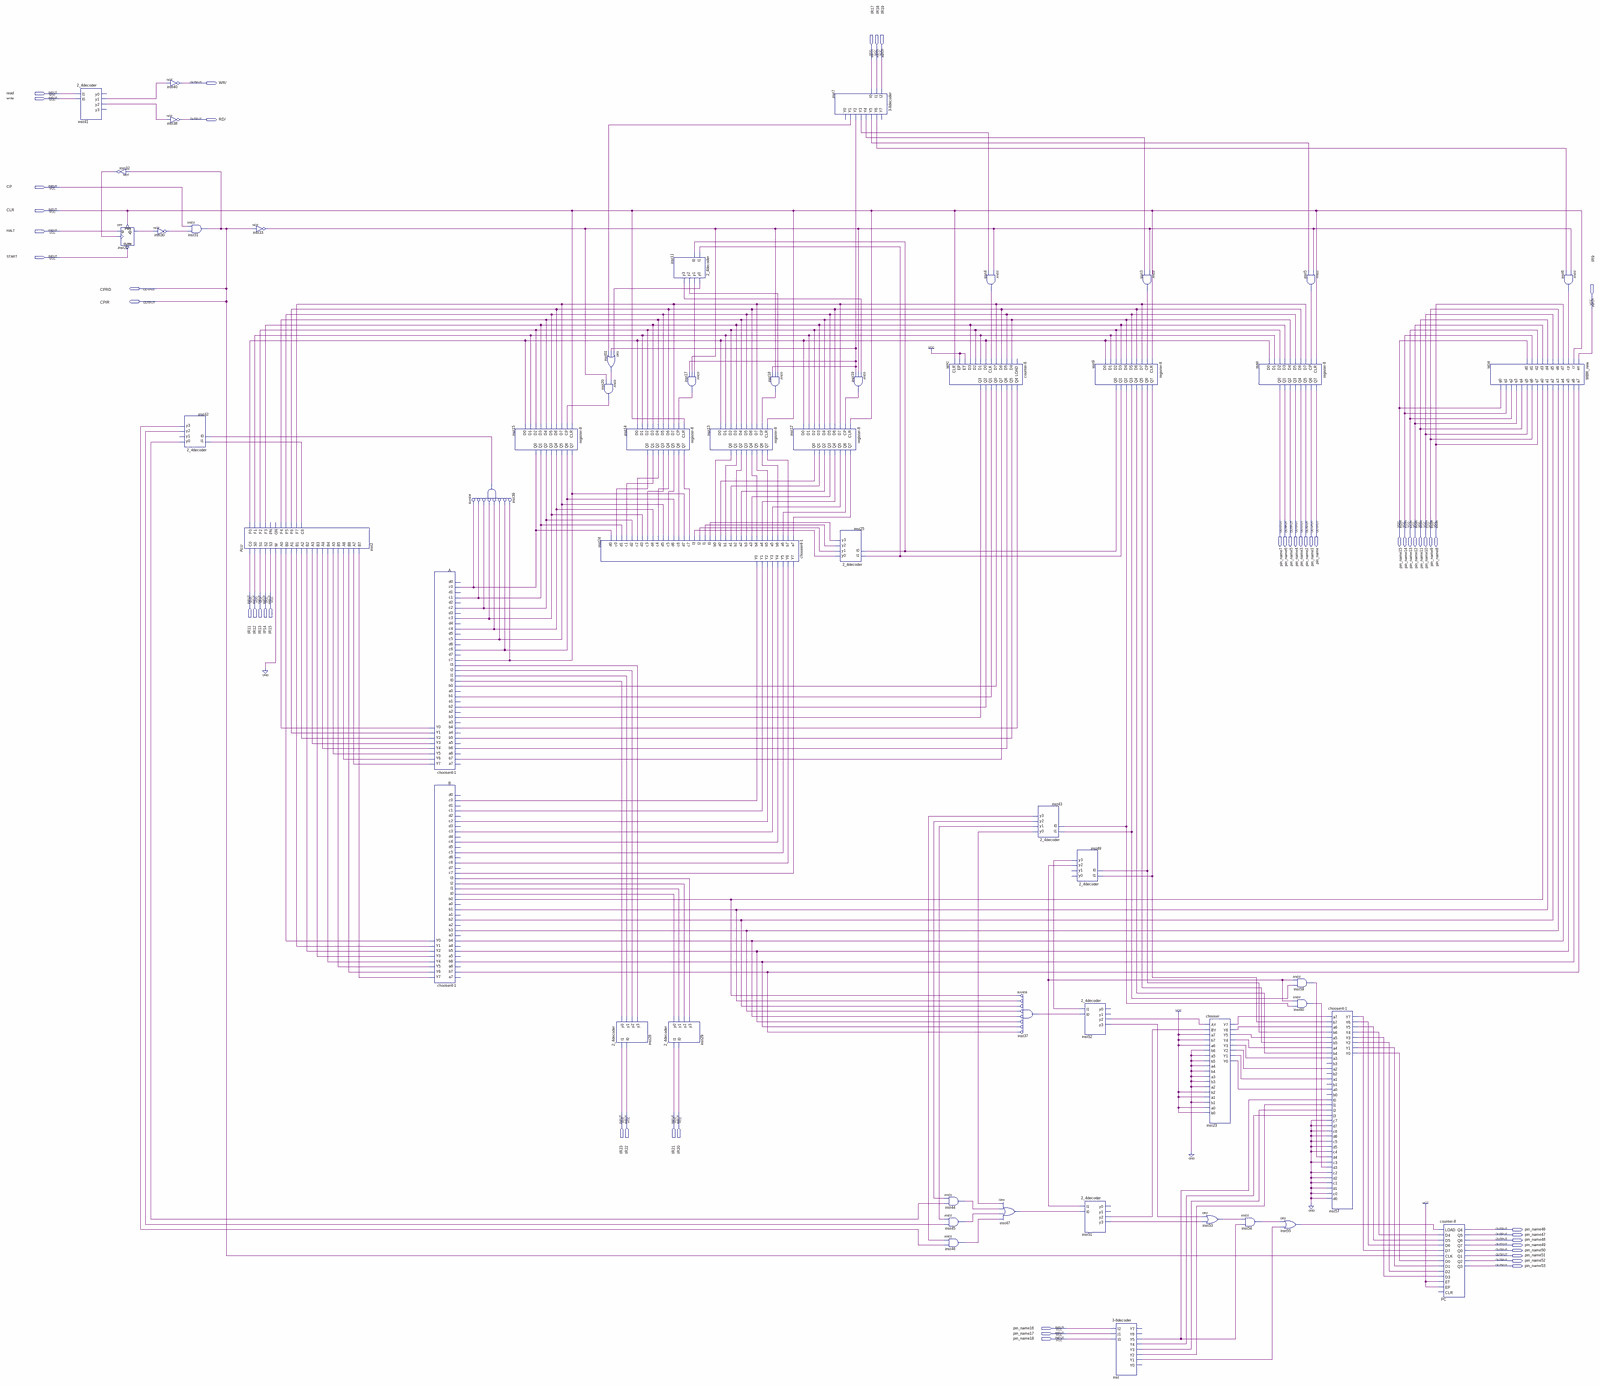
[diagram p0: schematic sheet, whole]
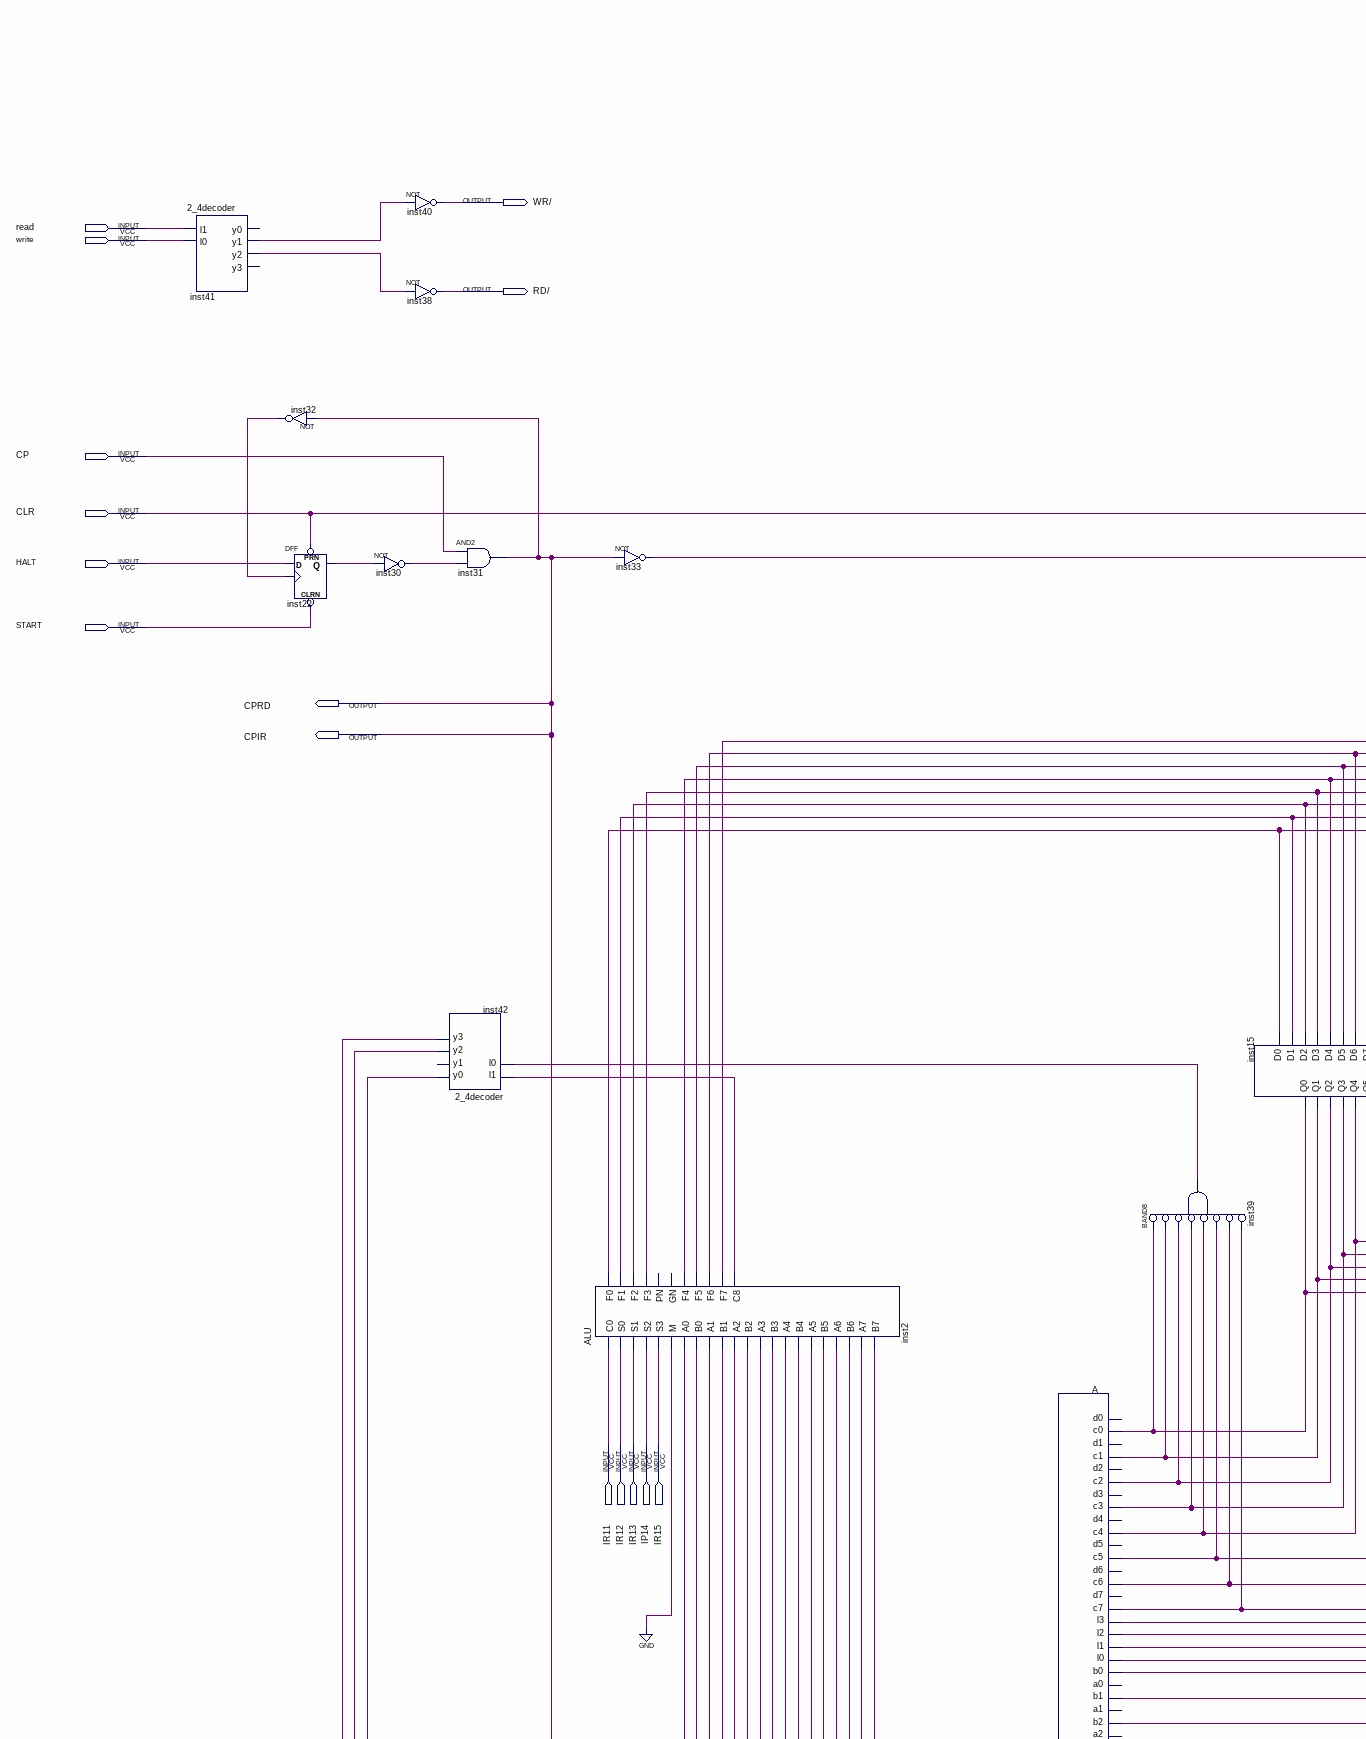
[diagram p1: schematic sheet, upper left part]
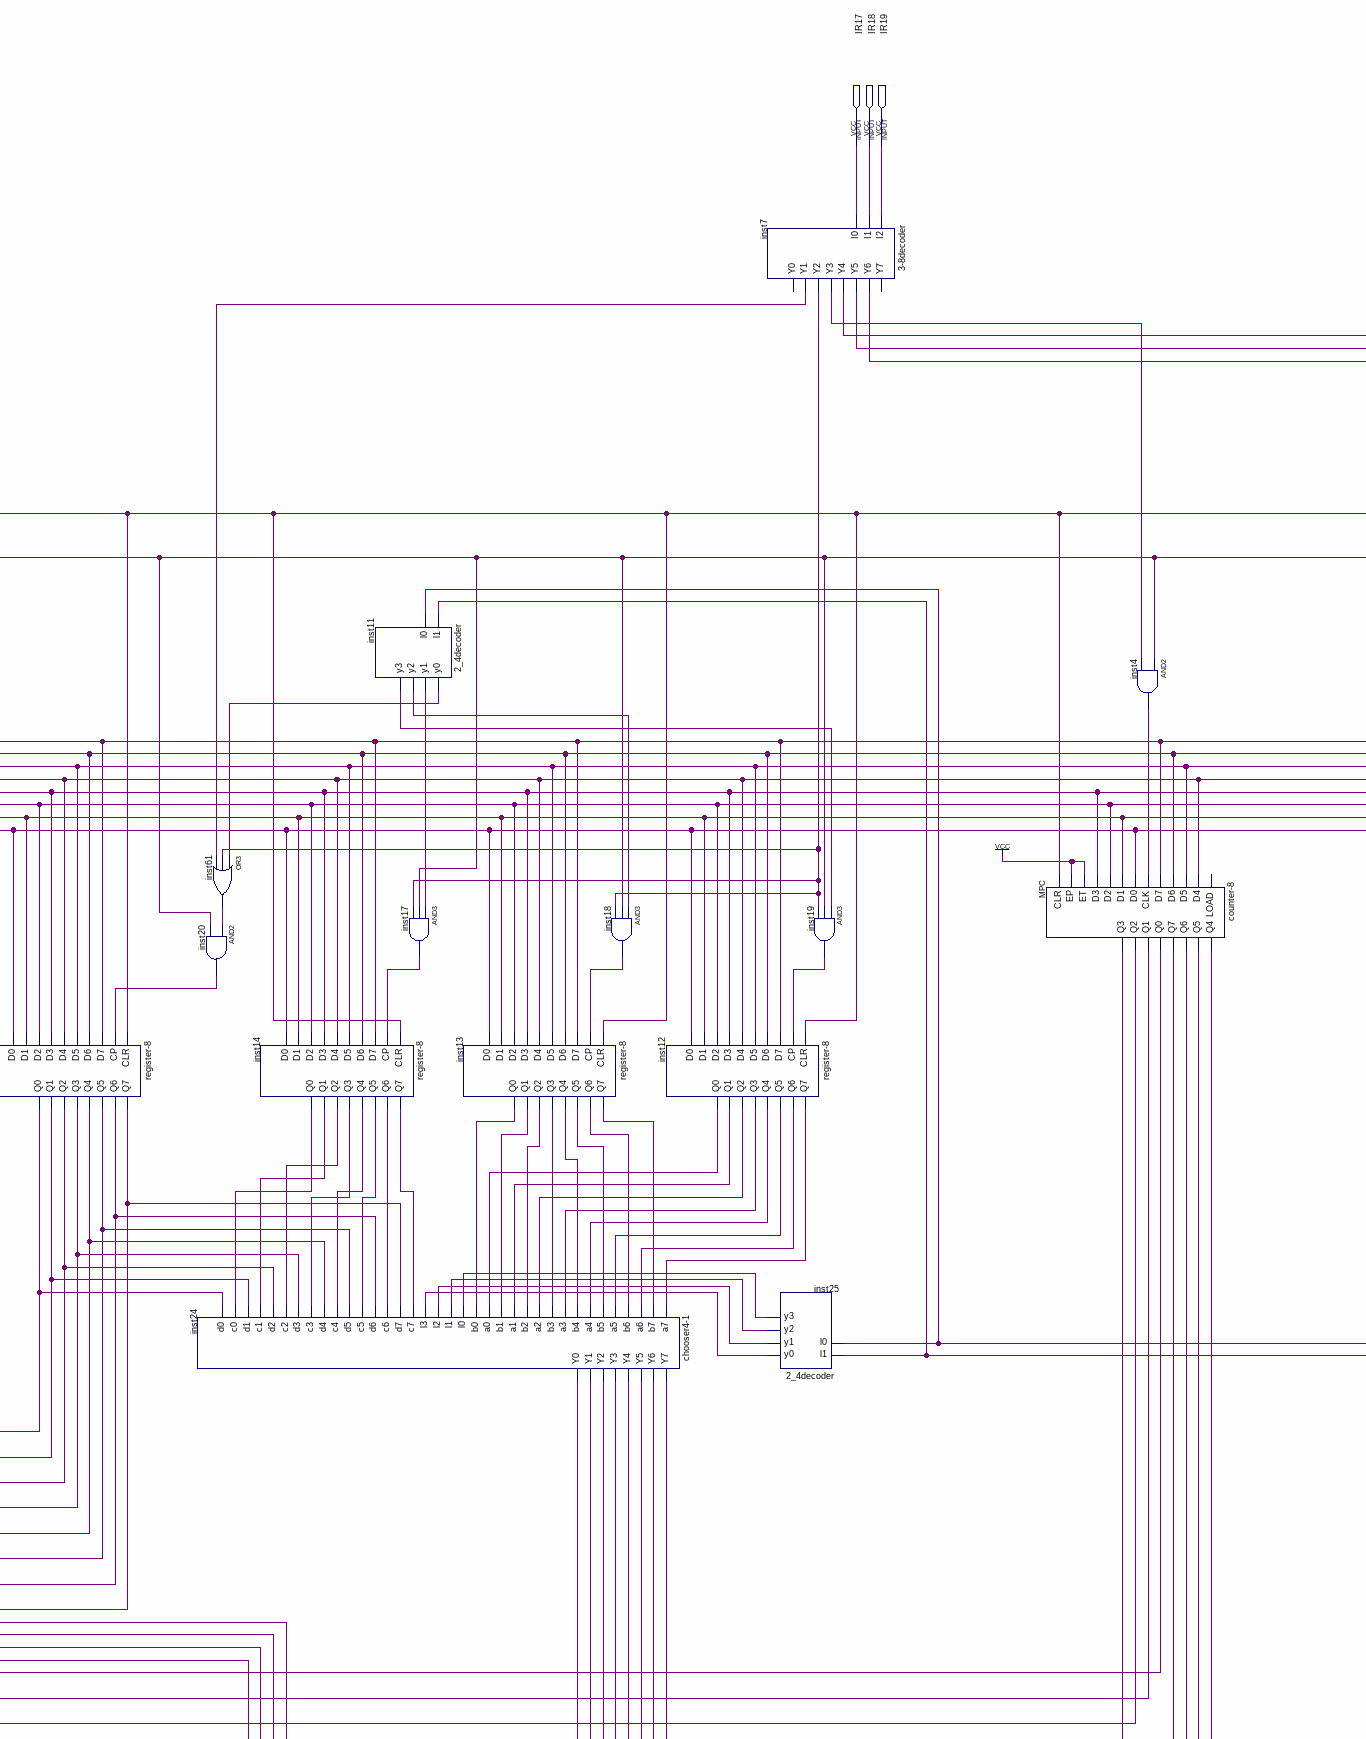
[diagram p2: schematic sheet, upper centre part]
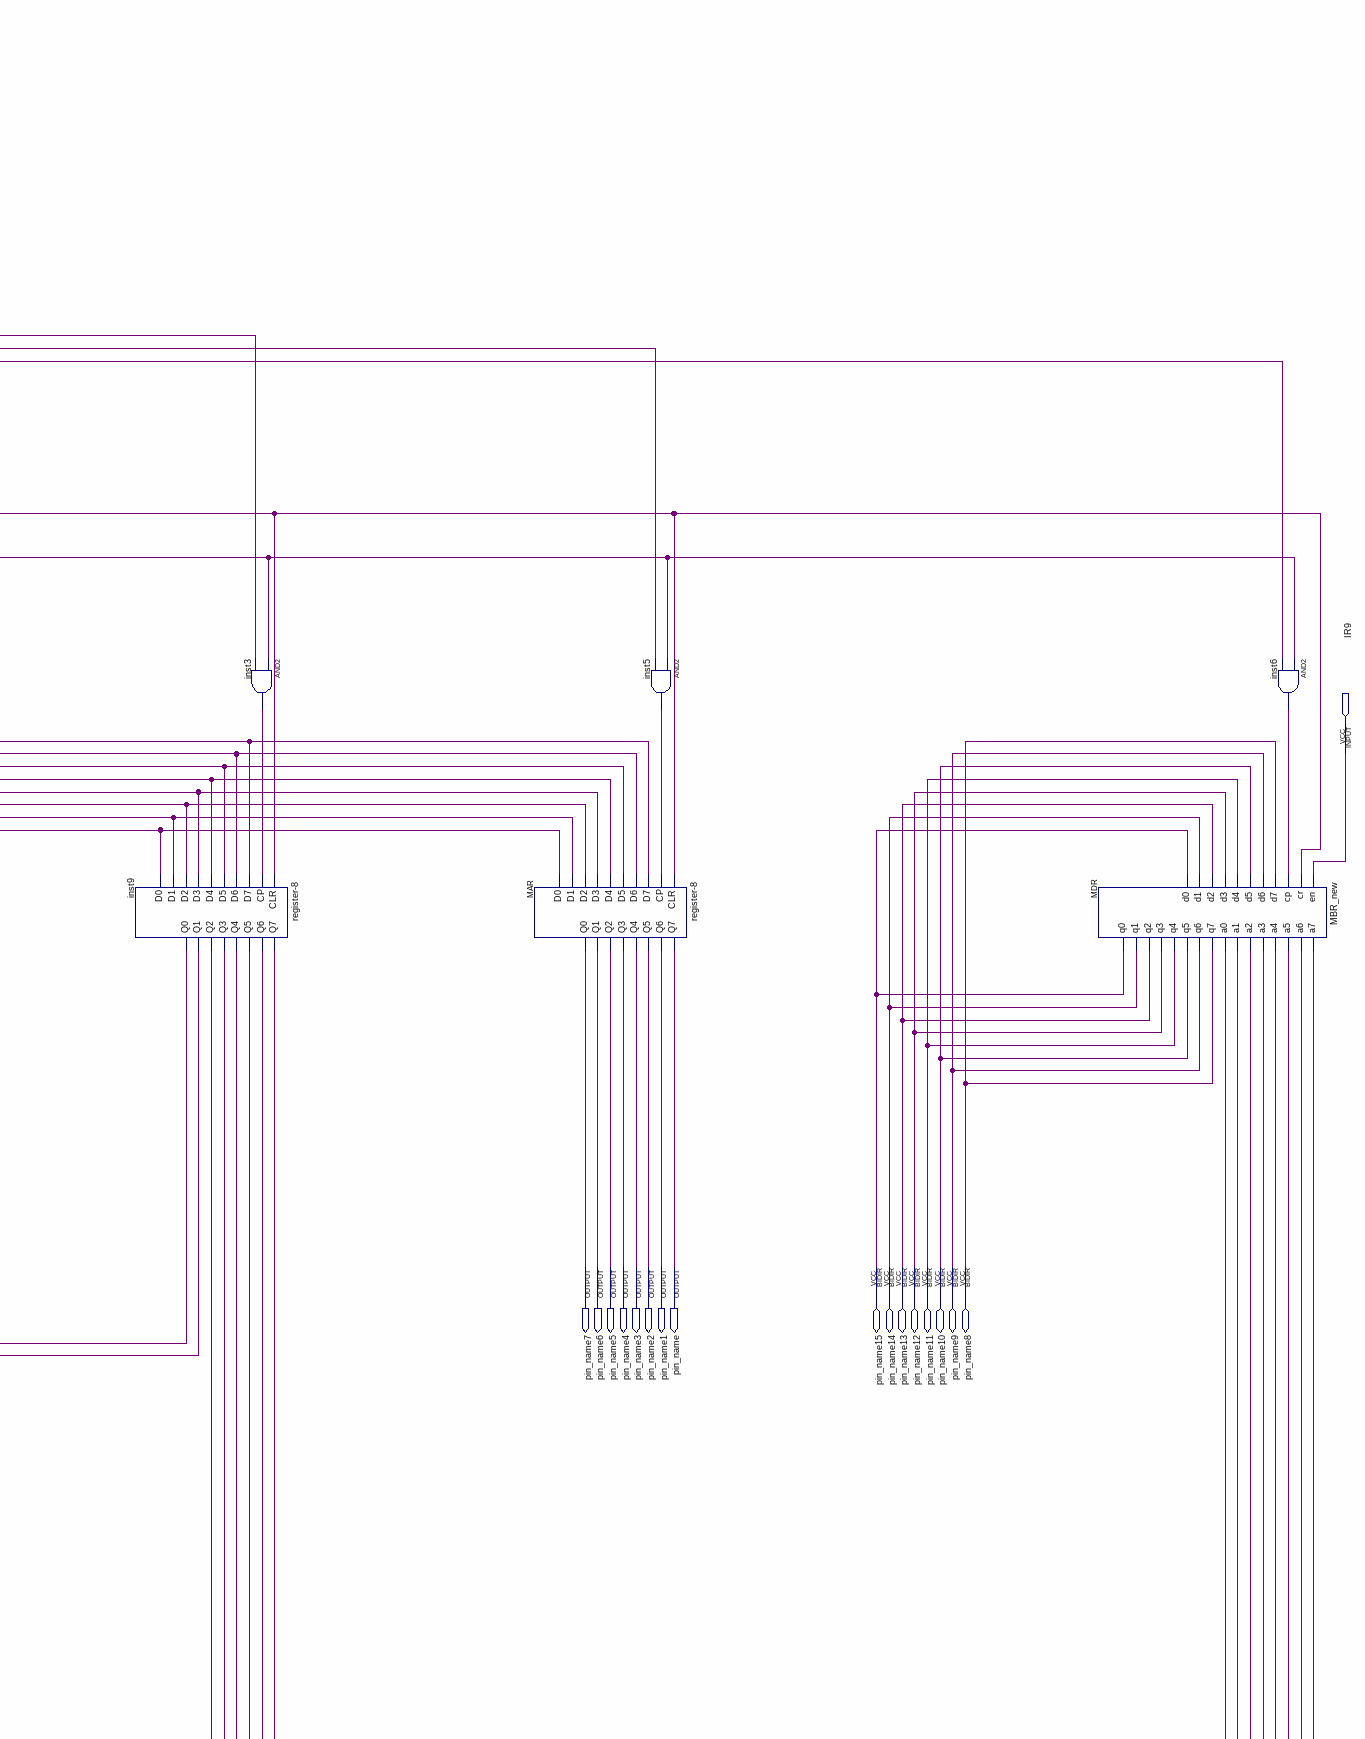
[diagram p3: schematic sheet, upper right part]
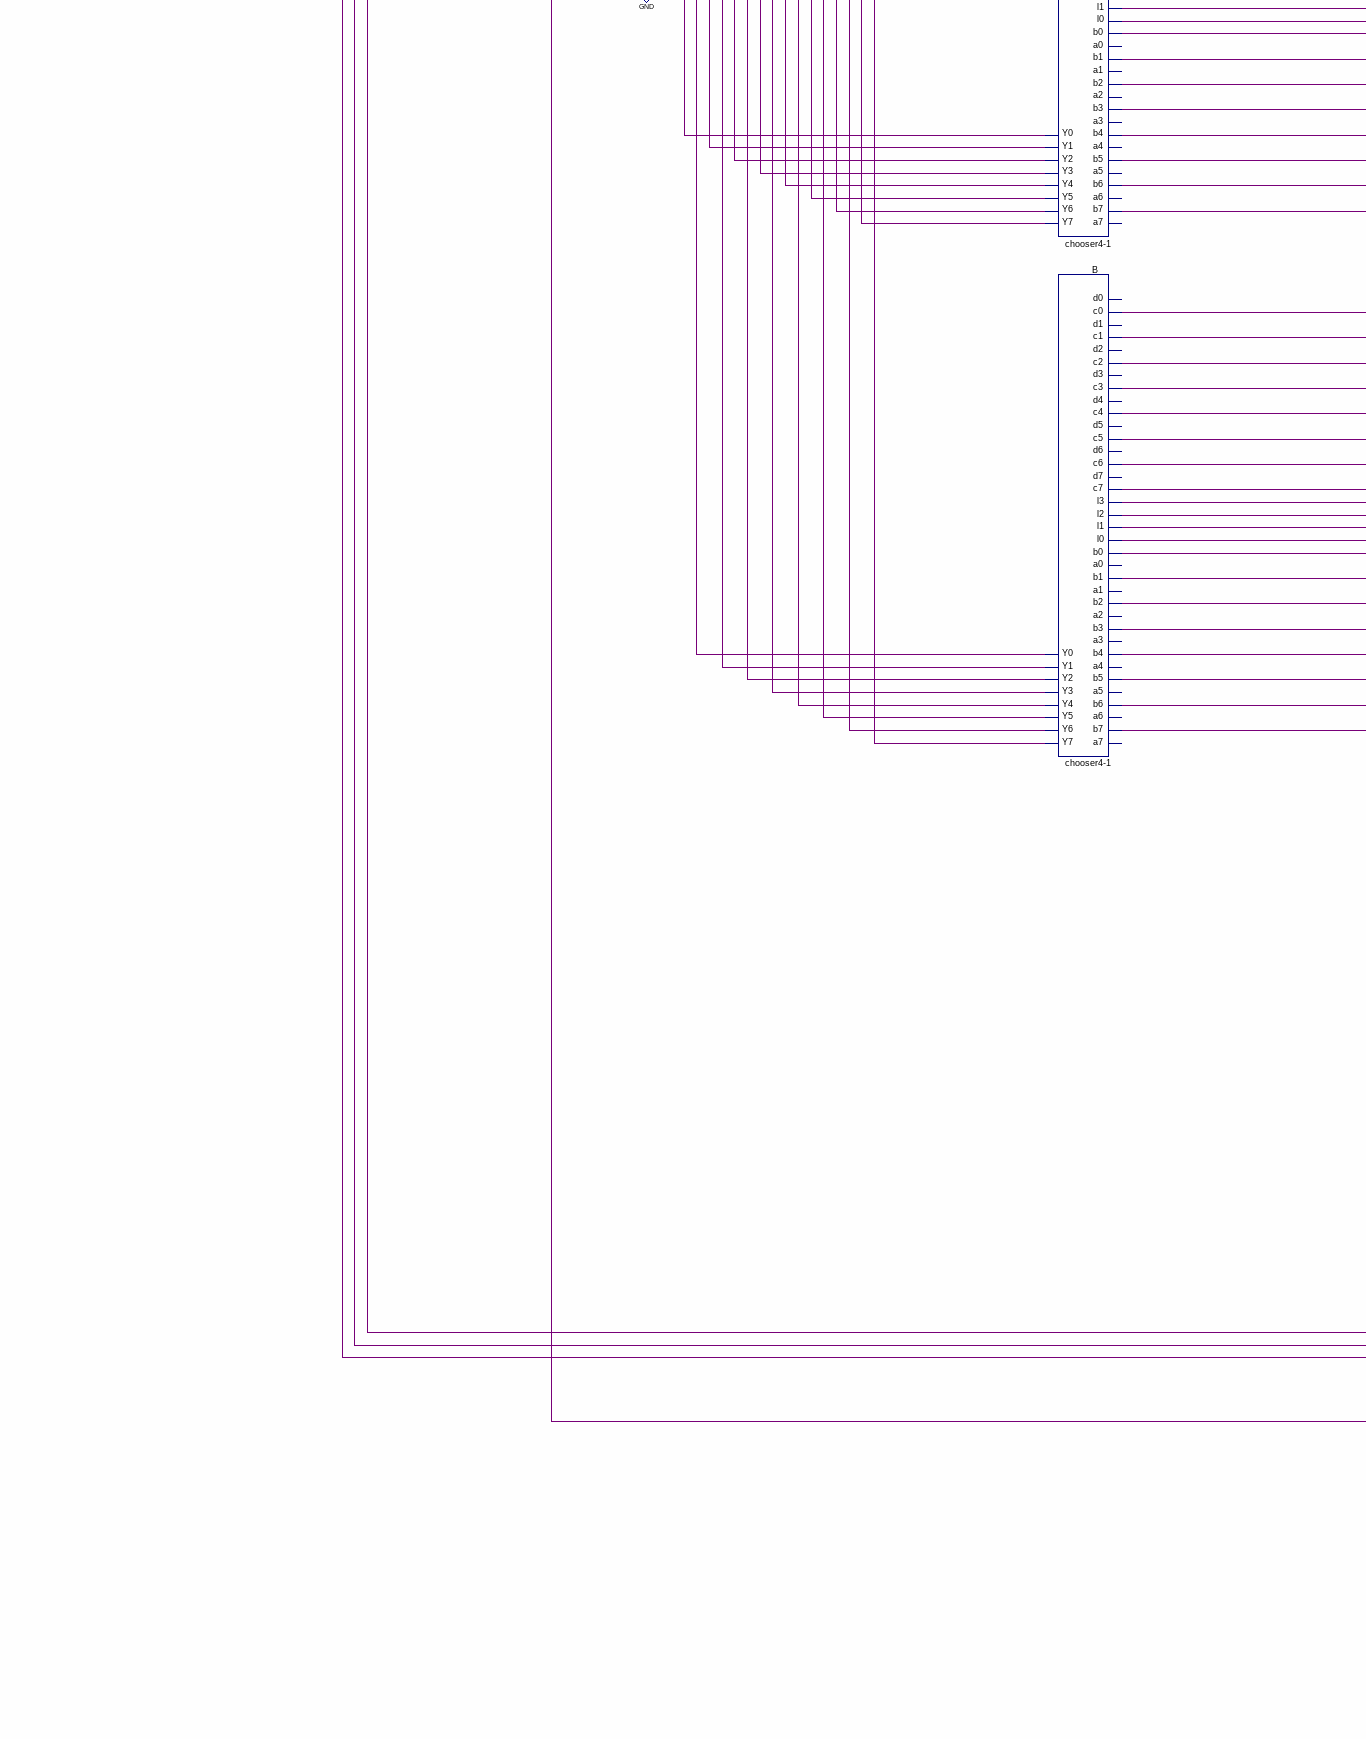
[diagram p4: schematic sheet, lower left part]
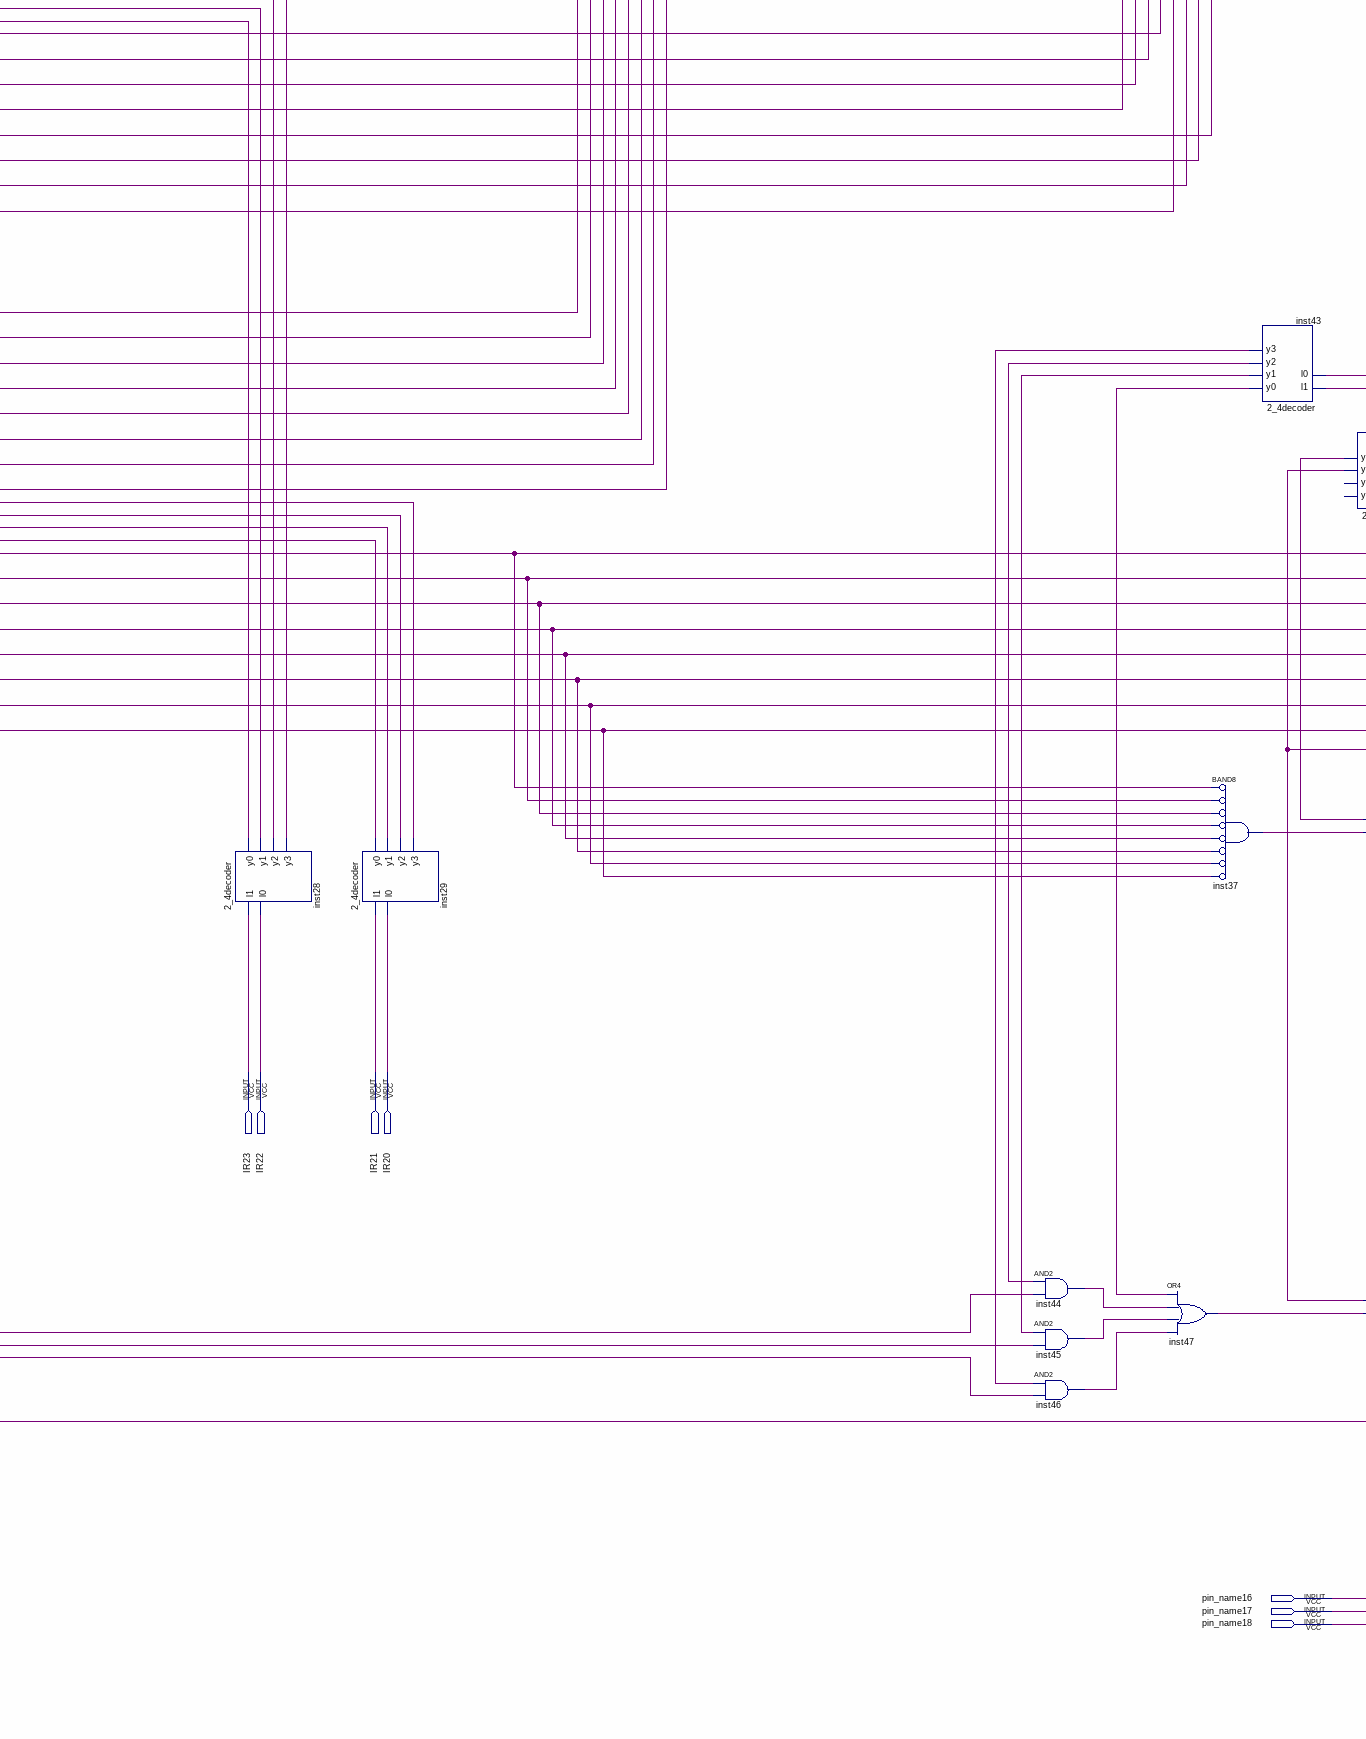
[diagram p5: schematic sheet, lower centre part]
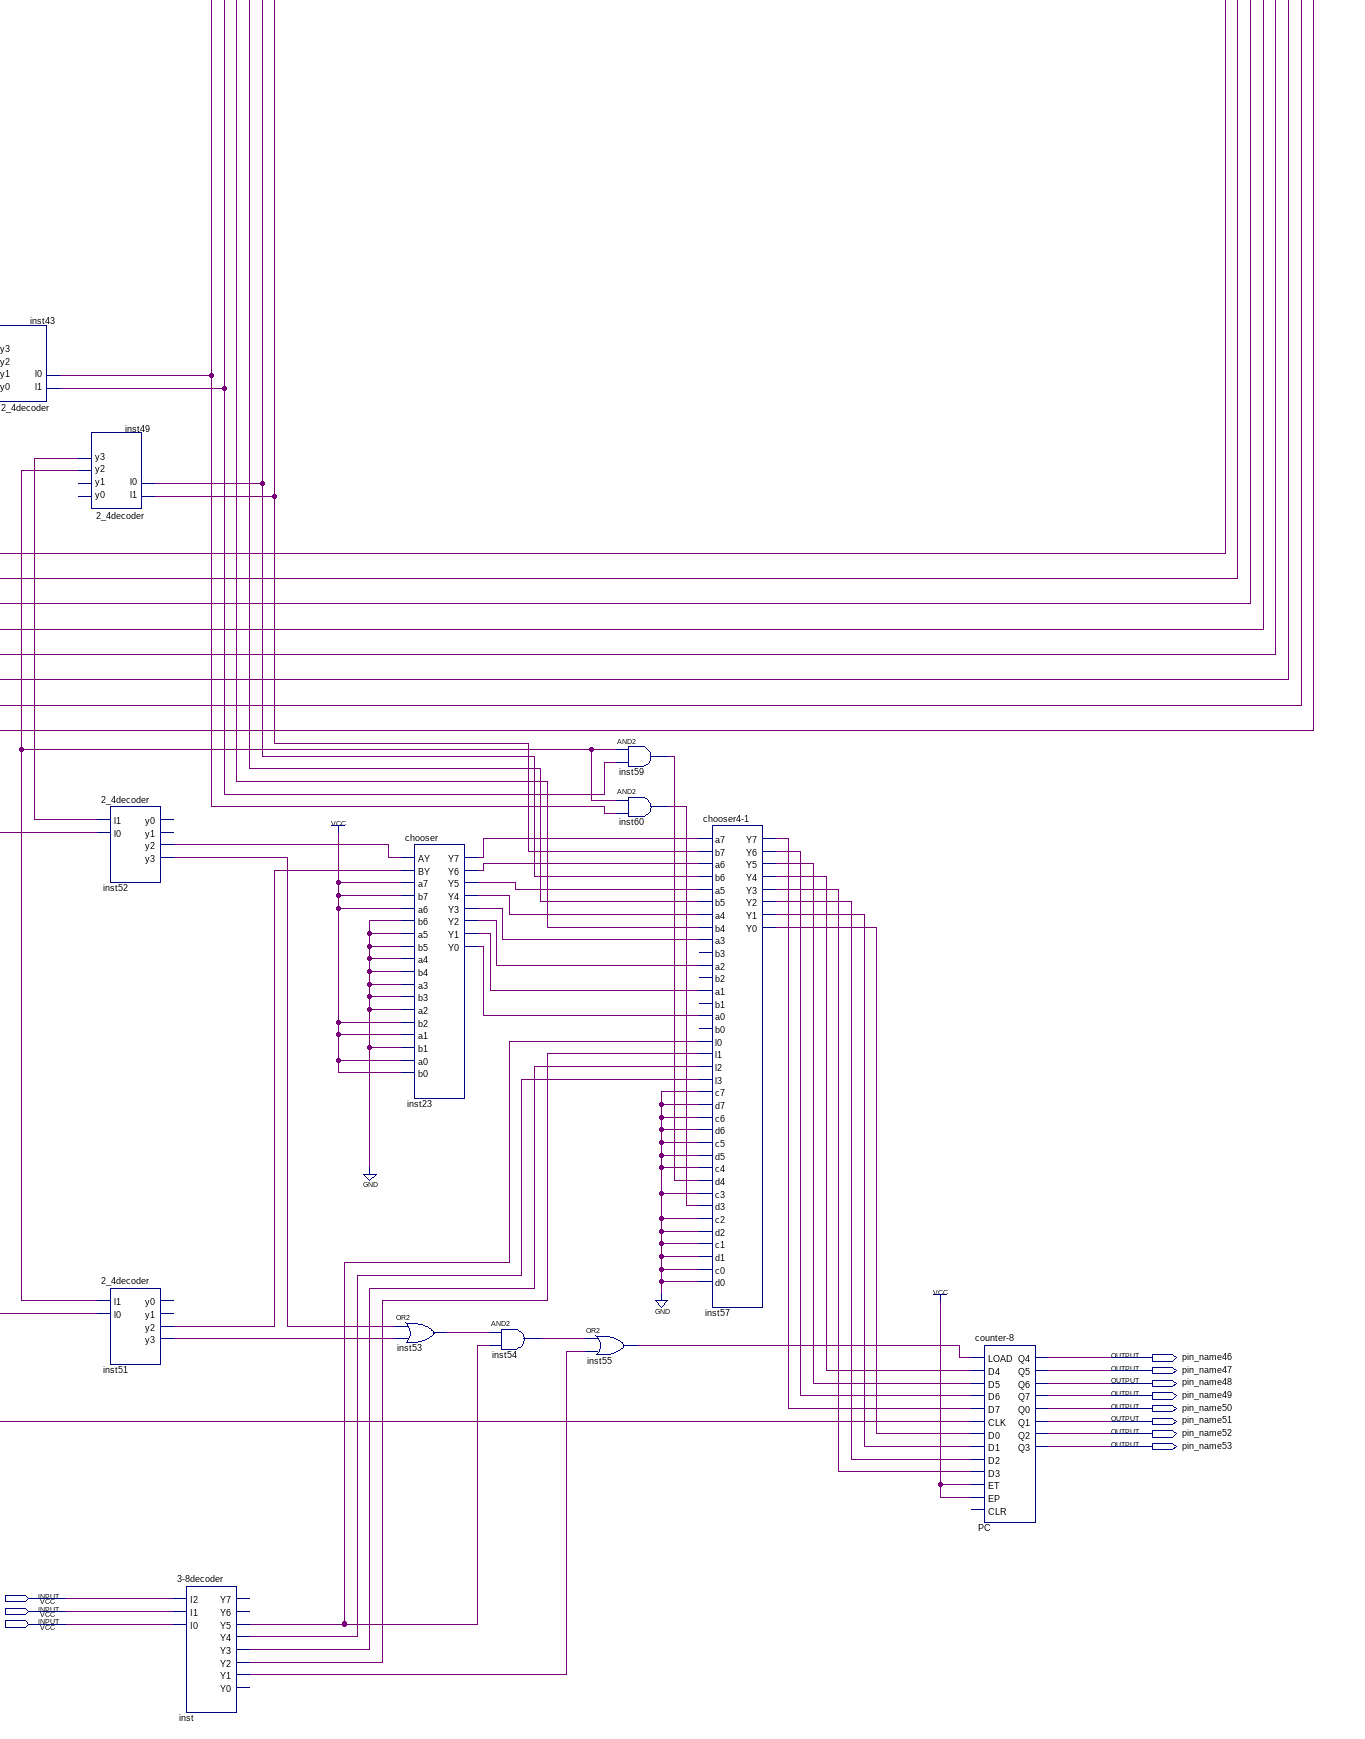
[diagram p6: schematic sheet, lower right part]
// Quartus schematic project.bdf as structural Verilog: 54 symbols, 50 pins
module project (
  input  IR17,
  input  IR18,
  input  IR19,
  input  read,
  input  write,
  input  CP,
  input  CLR,
  input  HALT,
  input  START,
  input  IR9,
  input  IR11,
  input  IR12,
  input  IR13,
  input  IP14,
  input  IR15,
  input  IR23,
  input  IR22,
  input  IR21,
  input  IR20,
  input  pin_name16,
  input  pin_name17,
  input  pin_name18,
  inout  pin_name15,
  inout  pin_name14,
  inout  pin_name13,
  inout  pin_name12,
  inout  pin_name11,
  inout  pin_name10,
  inout  pin_name9,
  inout  pin_name8,
  output \WR/ ,
  output \RD/ ,
  output CPRD,
  output CPIR,
  output pin_name7,
  output pin_name6,
  output pin_name5,
  output pin_name4,
  output pin_name3,
  output pin_name2,
  output pin_name1,
  output pin_name,
  output pin_name46,
  output pin_name47,
  output pin_name48,
  output pin_name49,
  output pin_name50,
  output pin_name51,
  output pin_name52,
  output pin_name53
);

  wire A_y0, A_y1, A_y2, A_y3, A_y4, A_y5, A_y6, A_y7, B_y0, B_y1, B_y2, B_y3, B_y4, B_y5, B_y6, B_y7,
       inst2_c8, inst2_f0, inst2_f1, inst2_f2, inst2_f3, inst2_f4, inst2_f5, inst2_f6, inst2_f7, inst3_out,
       inst4_out, inst5_out, inst6_out, inst7_y1, inst7_y2, inst7_y3, inst7_y4, inst7_y5, inst7_y6, inst9_q0,
       inst9_q1, inst9_q2, inst9_q3, inst9_q4, inst9_q5, inst9_q6, inst9_q7, inst11_y0, inst11_y1, inst11_y2,
       inst11_y3, inst12_q0, inst12_q1, inst12_q2, inst12_q3, inst12_q4, inst12_q5, inst12_q6, inst12_q7,
       inst13_q0, inst13_q1, inst13_q2, inst13_q3, inst13_q4, inst13_q5, inst13_q6, inst13_q7, inst14_q0,
       inst14_q1, inst14_q2, inst14_q3, inst14_q4, inst14_q5, inst14_q6, inst14_q7, inst15_q0, inst15_q1,
       inst15_q2, inst15_q3, inst15_q4, inst15_q5, inst15_q6, inst15_q7, inst17_out, inst18_out, inst19_out,
       inst20_out, inst22_q, inst23_y0, inst23_y1, inst23_y2, inst23_y3, inst23_y4, inst23_y5, inst23_y6,
       inst23_y7, inst24_y0, inst24_y1, inst24_y2, inst24_y3, inst24_y4, inst24_y5, inst24_y6, inst24_y7,
       inst25_y0, inst25_y1, inst25_y2, inst25_y3, inst28_y0, inst28_y1, inst28_y2, inst28_y3, inst29_y0,
       inst29_y1, inst29_y2, inst29_y3, inst30_out, inst32_out, inst33_out, inst37_out, inst39_out,
       inst41_y1, inst41_y2, inst42_y0, inst42_y2, inst42_y3, inst43_y0, inst43_y1, inst43_y2, inst43_y3,
       inst44_out, inst45_out, inst46_out, inst47_out, inst49_y2, inst49_y3, inst51_y2, inst51_y3, inst52_y2,
       inst52_y3, inst53_out, inst54_out, inst55_out, inst57_y0, inst57_y1, inst57_y2, inst57_y3, inst57_y4,
       inst57_y5, inst57_y6, inst57_y7, inst59_out, inst60_out, inst61_out, inst_y1, inst_y2, inst_y3,
       inst_y4, inst_y5, MDR_a0, MDR_a1, MDR_a2, MDR_a3, MDR_a4, MDR_a5, MDR_a6, MDR_a7, MPC_q0, MPC_q1,
       MPC_q2, MPC_q3, MPC_q4, MPC_q5, MPC_q6, MPC_q7;

  \2_4decoder  inst41 (.l1(read), .l0(write), .y1(inst41_y1), .y2(inst41_y2));  // open: y0, y3
  not inst32 (inst32_out, CPIR);
  DFF inst22 (.CLRN(START), .CLK(inst32_out), .D(HALT), .PRN(CLR), .Q(inst22_q));
  not inst30 (inst30_out, inst22_q);
  not inst40 (\WR/ , inst41_y1);
  not inst38 (\RD/ , inst41_y2);
  and inst31 (CPIR, CP, inst30_out);
  \2_4decoder  inst42 (.l1(inst2_c8), .l0(inst39_out), .y0(inst42_y0), .y2(inst42_y2), .y3(inst42_y3));  // open: y1
  not inst33 (inst33_out, CPIR);
  ALU inst2 (
    .C0(IR11), .S0(IR12), .S1(IR13), .S2(IP14), .S3(IR15), .M(1'b0), .A0(A_y0), .B0(B_y0), .A1(A_y1),
    .B1(B_y1), .A2(A_y2), .B2(B_y2), .A3(A_y3), .B3(B_y3), .A4(A_y4), .B4(B_y4), .A5(A_y5), .B5(B_y5),
    .A6(A_y6), .B6(B_y6), .A7(A_y7), .B7(B_y7), .F0(inst2_f0), .F1(inst2_f1), .F2(inst2_f2), .F3(inst2_f3),
    .F4(inst2_f4), .F5(inst2_f5), .F6(inst2_f6), .F7(inst2_f7), .C8(inst2_c8));  // open: PN, GN
  \chooser4-1  A (
    .b7(MPC_q7), .b6(MPC_q6), .b5(MPC_q5), .b4(MPC_q4), .b3(MPC_q3), .b2(MPC_q2), .b1(MPC_q1), .b0(MPC_q0),
    .l0(inst28_y0), .l1(inst28_y1), .l2(inst28_y2), .l3(inst28_y3), .c7(inst15_q7), .c6(inst15_q6),
    .c5(inst15_q5), .c4(inst15_q4), .c3(inst15_q3), .c2(inst15_q2), .c1(inst15_q1), .c0(inst15_q0),
    .Y7(A_y7), .Y6(A_y6), .Y5(A_y5), .Y4(A_y4), .Y3(A_y3), .Y2(A_y2), .Y1(A_y1), .Y0(A_y0));  // open: a7, a6, a5, a4, a3, a2, a1, a0, d7, d6, d5, d4, d3, d2, d1, d0
  \chooser4-1  B (
    .b7(MDR_a7), .b6(MDR_a6), .b5(MDR_a5), .b4(MDR_a4), .b3(MDR_a3), .b2(MDR_a2), .b1(MDR_a1), .b0(MDR_a0),
    .l0(inst29_y0), .l1(inst29_y1), .l2(inst29_y2), .l3(inst29_y3), .c7(inst24_y7), .c6(inst24_y6),
    .c5(inst24_y5), .c4(inst24_y4), .c3(inst24_y3), .c2(inst24_y2), .c1(inst24_y1), .c0(inst24_y0),
    .Y7(B_y7), .Y6(B_y6), .Y5(B_y5), .Y4(B_y4), .Y3(B_y3), .Y2(B_y2), .Y1(B_y1), .Y0(B_y0));  // open: a7, a6, a5, a4, a3, a2, a1, a0, d7, d6, d5, d4, d3, d2, d1, d0
  and inst39 (inst39_out, ~inst15_q0, ~inst15_q1, ~inst15_q2, ~inst15_q3, ~inst15_q4, ~inst15_q5, ~inst15_q6, ~inst15_q7);  // BAND8
  \register-8  inst15 (
    .CLR(CLR), .CP(inst20_out), .D7(inst2_f7), .D6(inst2_f6), .D5(inst2_f5), .D4(inst2_f4), .D3(inst2_f3),
    .D2(inst2_f2), .D1(inst2_f1), .D0(inst2_f0), .Q7(inst15_q7), .Q6(inst15_q6), .Q5(inst15_q5),
    .Q4(inst15_q4), .Q3(inst15_q3), .Q2(inst15_q2), .Q1(inst15_q1), .Q0(inst15_q0));
  or inst61 (inst61_out, inst11_y0, inst7_y2, inst7_y1);
  and inst20 (inst20_out, inst61_out, inst33_out);
  \chooser4-1  inst24 (
    .a7(inst12_q7), .b7(inst13_q7), .a6(inst12_q6), .b6(inst13_q6), .a5(inst12_q5), .b5(inst13_q5),
    .a4(inst12_q4), .b4(inst13_q4), .a3(inst12_q3), .b3(inst13_q3), .a2(inst12_q2), .b2(inst13_q2),
    .a1(inst12_q1), .b1(inst13_q1), .a0(inst12_q0), .b0(inst13_q0), .l0(inst25_y3), .l1(inst25_y2),
    .l2(inst25_y1), .l3(inst25_y0), .c7(inst14_q7), .d7(inst15_q7), .c6(inst14_q6), .d6(inst15_q6),
    .c5(inst14_q5), .d5(inst15_q5), .c4(inst14_q4), .d4(inst15_q4), .c3(inst14_q3), .d3(inst15_q3),
    .c2(inst14_q2), .d2(inst15_q2), .c1(inst14_q1), .d1(inst15_q1), .c0(inst14_q0), .d0(inst15_q0),
    .Y7(inst24_y7), .Y6(inst24_y6), .Y5(inst24_y5), .Y4(inst24_y4), .Y3(inst24_y3), .Y2(inst24_y2),
    .Y1(inst24_y1), .Y0(inst24_y0));
  \2_4decoder  inst28 (.l1(IR23), .l0(IR22), .y0(inst28_y0), .y1(inst28_y1), .y2(inst28_y2), .y3(inst28_y3));
  \register-8  inst14 (
    .CLR(CLR), .CP(inst17_out), .D7(inst2_f7), .D6(inst2_f6), .D5(inst2_f5), .D4(inst2_f4), .D3(inst2_f3),
    .D2(inst2_f2), .D1(inst2_f1), .D0(inst2_f0), .Q7(inst14_q7), .Q6(inst14_q6), .Q5(inst14_q5),
    .Q4(inst14_q4), .Q3(inst14_q3), .Q2(inst14_q2), .Q1(inst14_q1), .Q0(inst14_q0));
  \2_4decoder  inst11 (.l1(inst9_q1), .l0(inst9_q0), .y0(inst11_y0), .y1(inst11_y1), .y2(inst11_y2), .y3(inst11_y3));
  \2_4decoder  inst29 (.l1(IR21), .l0(IR20), .y0(inst29_y0), .y1(inst29_y1), .y2(inst29_y2), .y3(inst29_y3));
  and inst17 (inst17_out, inst11_y1, inst33_out, inst7_y2);
  \register-8  inst13 (
    .CLR(CLR), .CP(inst18_out), .D7(inst2_f7), .D6(inst2_f6), .D5(inst2_f5), .D4(inst2_f4), .D3(inst2_f3),
    .D2(inst2_f2), .D1(inst2_f1), .D0(inst2_f0), .Q7(inst13_q7), .Q6(inst13_q6), .Q5(inst13_q5),
    .Q4(inst13_q4), .Q3(inst13_q3), .Q2(inst13_q2), .Q1(inst13_q1), .Q0(inst13_q0));
  and inst18 (inst18_out, inst11_y2, inst33_out, inst7_y2);
  \register-8  inst12 (
    .CLR(CLR), .CP(inst19_out), .D7(inst2_f7), .D6(inst2_f6), .D5(inst2_f5), .D4(inst2_f4), .D3(inst2_f3),
    .D2(inst2_f2), .D1(inst2_f1), .D0(inst2_f0), .Q7(inst12_q7), .Q6(inst12_q6), .Q5(inst12_q5),
    .Q4(inst12_q4), .Q3(inst12_q3), .Q2(inst12_q2), .Q1(inst12_q1), .Q0(inst12_q0));
  \3-8decoder  inst7 (
    .I2(IR19), .I1(IR18), .I0(IR17), .Y6(inst7_y6), .Y5(inst7_y5), .Y4(inst7_y4), .Y3(inst7_y3),
    .Y2(inst7_y2), .Y1(inst7_y1));  // open: Y7, Y0
  \2_4decoder  inst25 (.l1(inst9_q1), .l0(inst9_q0), .y0(inst25_y0), .y1(inst25_y1), .y2(inst25_y2), .y3(inst25_y3));
  and inst19 (inst19_out, inst11_y3, inst33_out, inst7_y2);
  \counter-8  MPC (
    .D4(inst2_f4), .D5(inst2_f5), .D6(inst2_f6), .D7(inst2_f7), .CLK(inst4_out), .D0(inst2_f0),
    .D1(inst2_f1), .D2(inst2_f2), .D3(inst2_f3), .ET(1'b1), .EP(1'b1), .CLR(CLR), .Q4(MPC_q4), .Q5(MPC_q5),
    .Q6(MPC_q6), .Q7(MPC_q7), .Q0(MPC_q0), .Q1(MPC_q1), .Q2(MPC_q2), .Q3(MPC_q3));  // open: LOAD
  and inst44 (inst44_out, inst43_y2, inst42_y0);
  and inst45 (inst45_out, inst43_y1, inst42_y2);
  and inst46 (inst46_out, inst43_y3, inst42_y3);
  and inst4 (inst4_out, inst33_out, inst7_y3);
  or inst47 (inst47_out, inst43_y0, inst44_out, inst45_out, inst46_out);
  and inst37 (inst37_out, ~MDR_a0, ~MDR_a1, ~MDR_a2, ~MDR_a3, ~MDR_a4, ~MDR_a5, ~MDR_a6, ~MDR_a7);  // BAND8
  \2_4decoder  inst43 (.l1(inst9_q3), .l0(inst9_q2), .y0(inst43_y0), .y1(inst43_y1), .y2(inst43_y2), .y3(inst43_y3));
  \register-8  inst9 (
    .CLR(CLR), .CP(inst3_out), .D7(inst2_f7), .D6(inst2_f6), .D5(inst2_f5), .D4(inst2_f4), .D3(inst2_f3),
    .D2(inst2_f2), .D1(inst2_f1), .D0(inst2_f0), .Q7(inst9_q7), .Q6(inst9_q6), .Q5(inst9_q5), .Q4(inst9_q4),
    .Q3(inst9_q3), .Q2(inst9_q2), .Q1(inst9_q1), .Q0(inst9_q0));
  \2_4decoder  inst49 (.l1(inst9_q7), .l0(inst9_q6), .y2(inst49_y2), .y3(inst49_y3));  // open: y0, y1
  \2_4decoder  inst52 (.l1(inst49_y3), .l0(inst37_out), .y2(inst52_y2), .y3(inst52_y3));  // open: y0, y1
  \2_4decoder  inst51 (.l1(inst49_y2), .l0(inst47_out), .y2(inst51_y2), .y3(inst51_y3));  // open: y0, y1
  \3-8decoder  inst (
    .I2(pin_name16), .I1(pin_name17), .I0(pin_name18), .Y5(inst_y5), .Y4(inst_y4), .Y3(inst_y3),
    .Y2(inst_y2), .Y1(inst_y1));  // open: Y7, Y6, Y0
  and inst3 (inst3_out, inst33_out, inst7_y4);
  chooser inst23 (
    .AY(inst52_y2), .BY(inst51_y2), .a7(1'b1), .b7(1'b1), .a6(1'b1), .b6(1'b0), .a5(1'b0), .b5(1'b0),
    .a4(1'b0), .b4(1'b0), .a3(1'b0), .b3(1'b0), .a2(1'b0), .b2(1'b1), .a1(1'b1), .b1(1'b0), .a0(1'b1),
    .b0(1'b1), .Y7(inst23_y7), .Y6(inst23_y6), .Y5(inst23_y5), .Y4(inst23_y4), .Y3(inst23_y3),
    .Y2(inst23_y2), .Y1(inst23_y1), .Y0(inst23_y0));
  or inst53 (inst53_out, inst52_y3, inst51_y3);
  \register-8  MAR (
    .CLR(CLR), .CP(inst5_out), .D7(inst2_f7), .D6(inst2_f6), .D5(inst2_f5), .D4(inst2_f4), .D3(inst2_f3),
    .D2(inst2_f2), .D1(inst2_f1), .D0(inst2_f0), .Q7(pin_name), .Q6(pin_name1), .Q5(pin_name2),
    .Q4(pin_name3), .Q3(pin_name4), .Q2(pin_name5), .Q1(pin_name6), .Q0(pin_name7));
  and inst54 (inst54_out, inst53_out, inst_y5);
  and inst59 (inst59_out, inst49_y2, inst9_q3);
  and inst60 (inst60_out, inst49_y2, inst9_q2);
  or inst55 (inst55_out, inst54_out, inst_y1);
  and inst5 (inst5_out, inst33_out, inst7_y5);
  \chooser4-1  inst57 (
    .a7(inst23_y7), .b7(inst9_q7), .a6(inst23_y6), .b6(inst9_q6), .a5(inst23_y5), .b5(inst9_q5),
    .a4(inst23_y4), .b4(inst9_q4), .a3(inst23_y3), .a2(inst23_y2), .a1(inst23_y1), .a0(inst23_y0),
    .l0(inst_y5), .l1(inst_y2), .l2(inst_y3), .l3(inst_y4), .c7(1'b0), .d7(1'b0), .c6(1'b0), .d6(1'b0),
    .c5(1'b0), .d5(1'b0), .c4(1'b0), .d4(inst59_out), .c3(1'b0), .d3(inst60_out), .c2(1'b0), .d2(1'b0),
    .c1(1'b0), .d1(1'b0), .c0(1'b0), .d0(1'b0), .Y7(inst57_y7), .Y6(inst57_y6), .Y5(inst57_y5),
    .Y4(inst57_y4), .Y3(inst57_y3), .Y2(inst57_y2), .Y1(inst57_y1), .Y0(inst57_y0));  // open: b3, b2, b1, b0
  \counter-8  PC (
    .LOAD(inst55_out), .D4(inst57_y4), .D5(inst57_y5), .D6(inst57_y6), .D7(inst57_y7), .CLK(CPIR),
    .D0(inst57_y0), .D1(inst57_y1), .D2(inst57_y2), .D3(inst57_y3), .ET(1'b1), .EP(1'b1), .Q4(pin_name46),
    .Q5(pin_name47), .Q6(pin_name48), .Q7(pin_name49), .Q0(pin_name50), .Q1(pin_name51), .Q2(pin_name52),
    .Q3(pin_name53));  // open: CLR
  MBR_new MDR (
    .en(IR9), .cr(CLR), .cp(inst6_out), .d7(pin_name8), .d6(pin_name9), .d5(pin_name10), .d4(pin_name11),
    .d3(pin_name12), .d2(pin_name13), .d1(pin_name14), .d0(pin_name15), .a7(MDR_a7), .a6(MDR_a6),
    .a5(MDR_a5), .a4(MDR_a4), .a3(MDR_a3), .a2(MDR_a2), .a1(MDR_a1), .a0(MDR_a0), .q7(pin_name8),
    .q6(pin_name9), .q5(pin_name10), .q4(pin_name11), .q3(pin_name12), .q2(pin_name13), .q1(pin_name14),
    .q0(pin_name15));
  and inst6 (inst6_out, inst33_out, inst7_y6);

  assign CPRD = CPIR;
endmodule
